# Altium schematic sheet NG2094_IR_Flood.SchDoc: =project_title
size Tabloid; CompanyName: Luxonis Holding; Organization: Luxonis Holding; Address1: 1925 Harmony Park Drive; Address2: Westminster, CO; Address3: 80234; Address4: United States; SheetNumber: 9; SheetTotal: 10
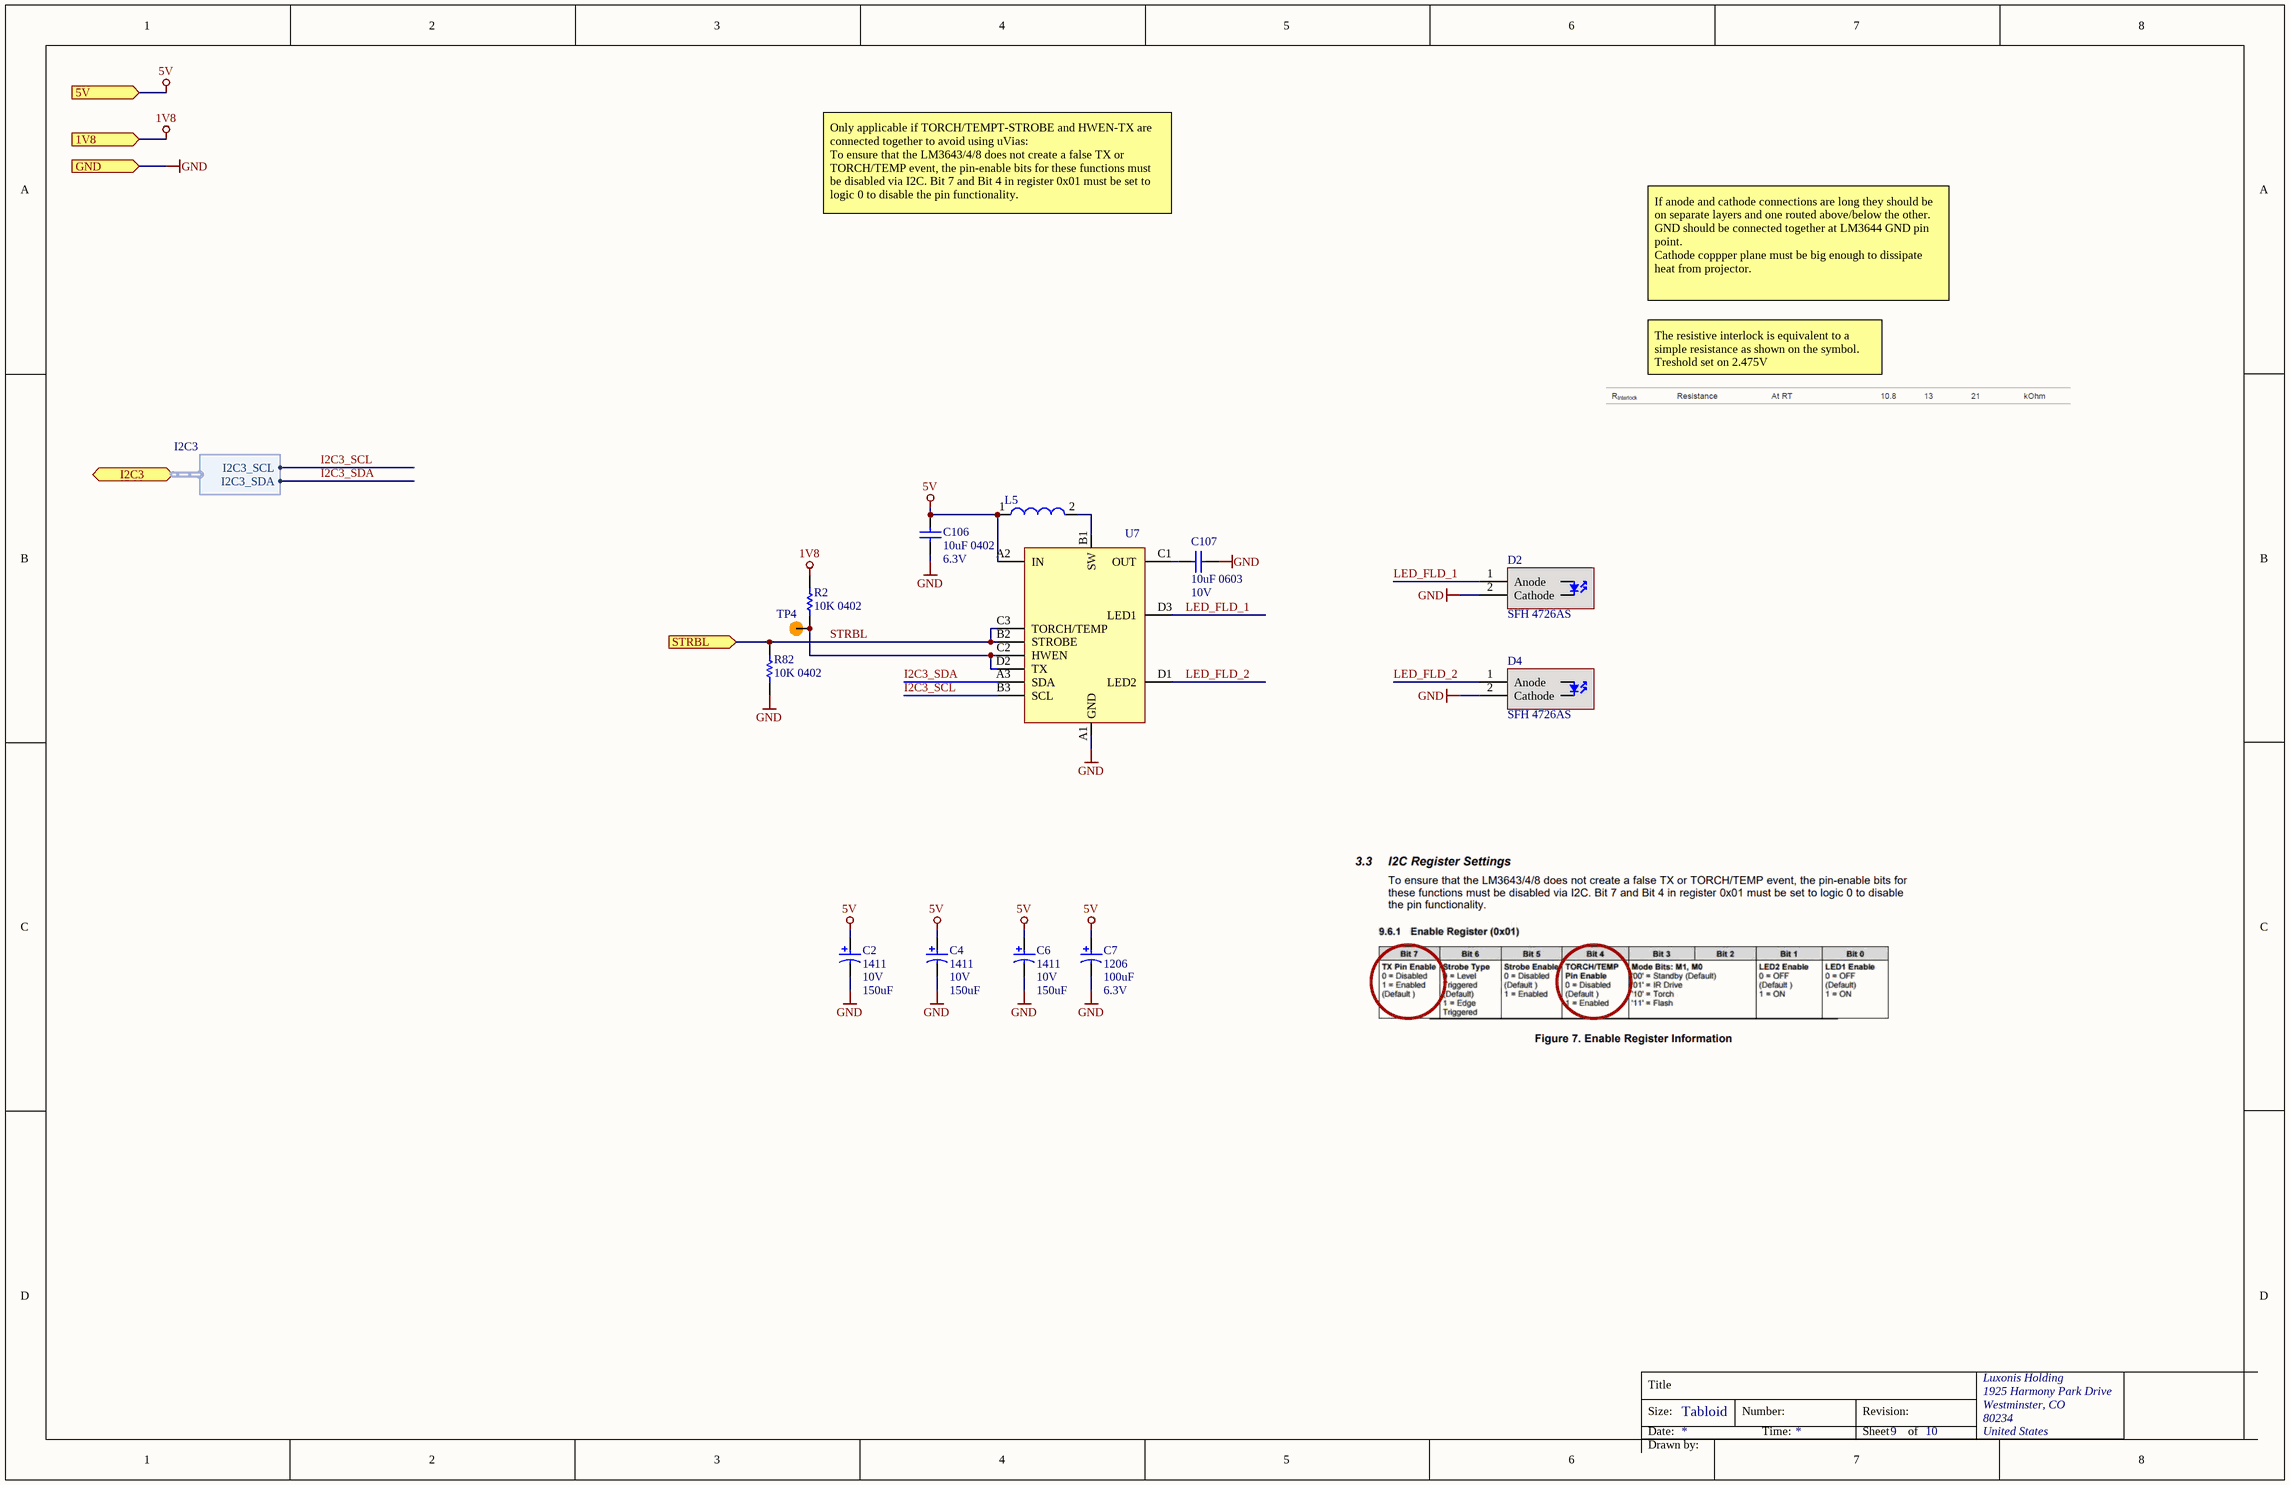
[diagram p0: NG2094_IR_Flood.SchDoc]

## Parts
C2  Size Code: 1411  Rated DC Voltage (URdc): 10V  Capacitance: 150uF  [RESTL1210(3225)_N]  (hidden comment: 150uF 1206 10V tantal)
C4  Size Code: 1411  Rated DC Voltage (URdc): 10V  Capacitance: 150uF  [RESTL1210(3225)_N]  (hidden comment: 150uF 1206 10V tantal)
C6  Size Code: 1411  Rated DC Voltage (URdc): 10V  Capacitance: 150uF  [RESTL1210(3225)_N]  (hidden comment: 150uF 1206 10V tantal)
C7  Size Code: 1206  Capacitance: 100uF  Rated DC Voltage (URdc): 6.3V  [RESTL1206(3216)_L]  (hidden comment: 100uF 1206 6V3 tantal)
C106  10uF 0402  Voltage Rating: 6.3V  [CAPC0402(1005)70_L]
C107  10uF 0603  Voltage Rating: 10V  [CAPC0603(1608)100_L]
D2  SFH 4726AS  [SFH 4726AS]
D4  SFH 4726AS  [SFH 4726AS]
L5  1uH, 3.2A, 20%  [DFE252012P-1R0M=P2]  (value not drawn)
R2  10K 0402  [RESC0402(1005)_L]
R82  10K 0402  [RESC0402(1005)_L]
TP4  TP100_200_NS  [TP100_200_NS]  (value not drawn)  (no BOM)
U7  LM3644YFFR  [LM3644YFFR]  (value not drawn)

## Ports
1V8 (in), 5V (in), GND (in), I2C3 (bidir, harness I2C3), STRBL (in)

## Harnesses
I2C3: I2C3_SCL, I2C3_SDA

## Nets
1V8: R2.2 ; port 1V8
5V: C2.1 C4.1 C6.1 C7.1 C106.2 L5.1 U7.A2(IN) ; port 5V
GND: C2.2 C4.2 C6.2 C7.2 C106.1 C107.2 D2.2(Cathode) D4.2(Cathode) R82.1 U7.A1(GND) ; port GND
I2C3_SCL: U7.B3(SCL) ; port I2C3.I2C3_SCL
I2C3_SDA: U7.A3(SDA) ; port I2C3.I2C3_SDA
LED_FLD_1: D2.1(Anode) U7.D3(LED1)
LED_FLD_2: D4.1(Anode) U7.D1(LED2)
STRBL: R82.2 U7.B2(STROBE) U7.C3(TORCH/TEMP) ; port STRBL
NetC107_1: C107.1 U7.C1(OUT)
NetL5_2: L5.2 U7.B1(SW)
NetR2_1: R2.1 TP4.1 U7.C2(HWEN) U7.D2(TX)

## Notes on the sheet
- Only applicable if TORCH/TEMPT-STROBE and HWEN-TX are connected together to avoid using uVias:
  To ensure that the LM3643/4/8 does not create a false TX or TORCH/TEMP event, the pin-enable bits for these functions must be disabled via I2C. Bit 7 and Bit 4 in register 0x01 must be set to logic 0 to disable the pin functionality.
- If anode and cathode connections are long they should be on separate layers and one routed above/below the other.
  GND should be connected together at LM3644 GND pin point.
  Cathode coppper plane must be big enough to dissipate heat from projector.
- The resistive interlock is equivalent to a simple resistance as shown on the symbol.
  Treshold set on 2.475V
- Title
- Size:
- Date:
- Tabloid
- Number:
- Time:
- Revision:
- Sheet
- of
- Drawn by:

## Library data of the parts
C2 C4 C6 = TLJB157M010R0500: Tantalum Capacitor, Polarized, Tantalum (dry/solid), 10V, 20% +Tol, 20% -Tol, 150uF, Surface Mount, 1210; Manufacturer 1: Kyocera AVX; ESR (Equivalent Series Resistance): 500mR; Leakage Current: 15uA; Ripple Current: 371mA; Supplier 1: Digi-Key; Manufacturer Part Number 1: TLJB157M010R0500; RoHS: Yes; Category: Tantalum Capacitors; Stock 1: 10000; Pricing 1: 1=0,74000, 10=0,54700, 50=0,43800, 100=0,37540, 500=0,29716, 1000=0,25024 (USD); Mount: Surface Mount; Number of Pins: 2; Dielectric Material: Tantalum; Package Shape: Rectangular; Terminal Finish: Nickel; Min Operating Temperature: -55°C; Max Operating Temperature: 125°C; JESD-609 Code: e3; Polarity: Polarized; Capacitor Type: Tantalum; Negative Tolerance: 20%; Package Style: SMTMeter; Packaging: Tape and Reel; Positive Tolerance: 20%; Termination: J BEND; Length: 3.5mm; Width: 2.8mm; Height: 1.9mm; REACH SVHC: Yes; RoHS Compliant: Yes; ComponentLink1URL: https://datasheet.ciiva.com:443/pdfs/VipMasterIC/IC/AVXC/AVXC-S-A0008508048/AVXC-S-A0008508048-1.pdf?src-supplier=IHS+Markit; ComponentLink1Description: https://datasheet.ciiva.com:443/pdfs/VipMasterIC/IC/AVXC/AVXC-S-A0008508048/AVXC-S-A0008508048-1.pdf?src-supplier=IHS+Markit; ComponentLink2URL: https://datasheet.ciiva.com/264/tlj-264786.pdf?src-supplier=Digi-Key; ComponentLink2Description: https://datasheet.ciiva.com/264/tlj-264786.pdf?src-supplier=Digi-Key; ComponentLink3URL: https://datasheet.ciiva.com/264/tlj-264787.pdf?src-supplier=Digi-Key; ComponentLink3Description: https://datasheet.ciiva.com/264/tlj-264787.pdf?src-supplier=Digi-Key; ComponentLink4URL: https://datasheet.ciiva.com/264/tlj-264788.pdf?src-supplier=Digi-Key; ComponentLink4Description: https://datasheet.ciiva.com/264/tlj-264788.pdf?src-supplier=Digi-Key; ComponentLink5URL: https://datasheet.ciiva.com/46385/1910903-46385237.pdf?src-supplier=Element14; ComponentLink5Description: https://datasheet.ciiva.com/46385/1910903-46385237.pdf?src-supplier=Element14; ComponentLink6URL: https://datasheet.ciiva.com/28515/tlj-28515528.pdf?src-supplier=Element14; ComponentLink6Description: https://datasheet.ciiva.com/28515/tlj-28515528.pdf?src-supplier=Element14; ComponentLink7URL: https://datasheet.ciiva.com/7773/1533257-7773833.pdf?src-supplier=Element14; ComponentLink7Description: https://datasheet.ciiva.com/7773/1533257-7773833.pdf?src-supplier=Element14; ComponentLink8URL: https://datasheet.ciiva.com/14593/70001364-14593673.pdf?src-supplier=Allied+Electronics; ComponentLink8Description: https://datasheet.ciiva.com/14593/70001364-14593673.pdf?src-supplier=Allied+Electronics; ComponentLink9URL: https://datasheet.ciiva.com/14606/70001364-14606409.pdf?src-supplier=Allied+Electronics; ComponentLink9Description: https://datasheet.ciiva.com/14606/70001364-14606409.pdf?src-supplier=Allied+Electronics; ComponentLink10URL: https://datasheet.ciiva.com/7773/1533257-7773834.pdf?src-supplier=Element14; ComponentLink10Description: https://datasheet.ciiva.com/7773/1533257-7773834.pdf?src-supplier=Element14; ComponentLink11URL: https://datasheet.ciiva.com/11229/tlj-11229389.pdf?src-supplier=Avnet; ComponentLink11Description: https://datasheet.ciiva.com/11229/tlj-11229389.pdf?src-supplier=Avnet; ComponentLink12URL: https://datasheet.ciiva.com/17339/tlj-17339422.pdf?src-supplier=Avnet+Europe; ComponentLink12Description: https://datasheet.ciiva.com/17339/tlj-17339422.pdf?src-supplier=Avnet+Europe; Supplier Part Number 1: 478-3349-1-ND
C7 = TLJA107M006R0500: Tantalum Capacitor, Polarized, Tantalum (dry/solid), 6.3V, 20% +Tol, 20% -Tol, 100uF, Surface Mount, 1206; Manufacturer 1: Kyocera AVX; ESR (Equivalent Series Resistance): 500mR; Leakage Current: 6uA; Ripple Current: 349mA; Supplier 1: Digi-Key; Manufacturer Part Number 1: TLJA107M006R0500; RoHS: Yes; Category: Tantalum Capacitors; Stock 1: 1699; Pricing 1: 1=0,68000, 10=0,49800, 50=0,39840, 100=0,34150, 500=0,27036, 1000=0,22768 (USD); Mount: Surface Mount; Number of Pins: 2; Dielectric Material: Tantalum; Package Shape: Rectangular; Terminal Finish: Nickel; Min Operating Temperature: -55°C; Max Operating Temperature: 125°C; JESD-609 Code: e3; Polarity: Polarized; Capacitor Type: Tantalum; Negative Tolerance: 20%; Package Style: SMTMeter; Packaging: Tape and Reel; Positive Tolerance: 20%; Termination: J BEND; Length: 3.2mm; Width: 1.6mm; Height: 1.6mm; REACH SVHC: Yes; RoHS Compliant: Yes; ComponentLink1URL: https://datasheet.ciiva.com:443/pdfs/VipMasterIC/IC/AVXC/AVXC-S-A0008508048/AVXC-S-A0008508048-1.pdf?src-supplier=IHS+Markit; ComponentLink1Description: https://datasheet.ciiva.com:443/pdfs/VipMasterIC/IC/AVXC/AVXC-S-A0008508048/AVXC-S-A0008508048-1.pdf?src-supplier=IHS+Markit; ComponentLink2URL: https://datasheet.ciiva.com/3797/21tlj-3797551.pdf?src-supplier=Arrow+Electronics; ComponentLink2Description: https://datasheet.ciiva.com/3797/21tlj-3797551.pdf?src-supplier=Arrow+Electronics; ComponentLink3URL: https://datasheet.ciiva.com/7720/1533257-7720677.pdf?src-supplier=Element14; ComponentLink3Description: https://datasheet.ciiva.com/7720/1533257-7720677.pdf?src-supplier=Element14; ComponentLink4URL: https://datasheet.ciiva.com/28609/packmark-28609461.pdf?src-supplier=Element14; ComponentLink4Description: https://datasheet.ciiva.com/28609/packmark-28609461.pdf?src-supplier=Element14; ComponentLink5URL: https://datasheet.ciiva.com/264/tlj-264694.pdf?src-supplier=Digi-Key; ComponentLink5Description: https://datasheet.ciiva.com/264/tlj-264694.pdf?src-supplier=Digi-Key; ComponentLink6URL: https://datasheet.ciiva.com/264/tlj-264695.pdf?src-supplier=Digi-Key; ComponentLink6Description: https://datasheet.ciiva.com/264/tlj-264695.pdf?src-supplier=Digi-Key; ComponentLink7URL: https://datasheet.ciiva.com/264/tlj-264696.pdf?src-supplier=Digi-Key; ComponentLink7Description: https://datasheet.ciiva.com/264/tlj-264696.pdf?src-supplier=Digi-Key; ComponentLink8URL: https://datasheet.ciiva.com/11229/tlj-11229385.pdf?src-supplier=Avnet; ComponentLink8Description: https://datasheet.ciiva.com/11229/tlj-11229385.pdf?src-supplier=Avnet; ComponentLink9URL: https://datasheet.ciiva.com/28609/1910903-28609449.pdf?src-supplier=Element14; ComponentLink9Description: https://datasheet.ciiva.com/28609/1910903-28609449.pdf?src-supplier=Element14; ComponentLink10URL: https://datasheet.ciiva.com/16501/tlj-16501341.pdf?src-supplier=Future+Electronics; ComponentLink10Description: https://datasheet.ciiva.com/16501/tlj-16501341.pdf?src-supplier=Future+Electronics; ComponentLink11URL: https://datasheet.ciiva.com/14590/70001364-14590207.pdf?src-supplier=Allied+Electronics; ComponentLink11Description: https://datasheet.ciiva.com/14590/70001364-14590207.pdf?src-supplier=Allied+Electronics; Supplier Part Number 1: 478-3345-1-ND
C106 = GRM155R60J106ME15D: CAP CER 10UF 6.3V X5R 0402 20%; Manufacturer 1: Murata; Supplier 1: Digi-Key; Manufacturer Part Number 1: GRM155R60J106ME15D; Stock 1: 1839627; Pricing 1: 1=0.23000, 10=0.15700, 100=0.07950, 500=0.05442, 1000=0.04814, 2500=0.04605, 5000=0.04186 (USD); RoHS: Yes; Mount: Surface Mount; Case/Package: 0402; Case Code (Metric): 1005; Case Code (Imperial): 0402; Min Operating Temperature: -55°C; Max Operating Temperature: 85°C; Packaging: Tape and Reel; Capacitance: 10uF; Dielectric: X5R; Length: 0.039inch; Width: 0.02inch; ComponentLink1URL: https://www.murata.com/~/media/webrenewal/support/library/catalog/products/capacitor/mlcc/c02e.ashx?la=en-us&src-supplier=Digi-Key; ComponentLink1Description: https://www.murata.com/~/media/webrenewal/support/library/catalog/products/capacitor/mlcc/c02e.ashx?la=en-us&src-supplier=Digi-Key; Supplier Part Number 1: 490-13238-1-ND; Voltage Rating (DC): 6.3V; Thickness: 0.026inch; Tolerance: 20%
C107 = GRM188R61A106ME69D: CAP CER 10UF 10V X5R 0603 20%; Manufacturer 1: Murata; Material: Ceramic; Supplier 1: Digi-Key; Manufacturer Part Number 1: GRM188R61A106ME69D; Stock 1: 2873098; Pricing 1: 1=0.21000, 10=0.14100, 100=0.07130, 500=0.04876, 1000=0.04313 (USD); RoHS: Yes; Mount: Surface Mount; Case/Package: 0603; Weight: 0.000222oz; Case Code (Metric): 1608; Case Code (Imperial): 0603; Min Operating Temperature: -55°C; Max Operating Temperature: 85°C; Packaging: Tape and Reel; Tolerance: 20%; Capacitance: 10uF; Dielectric: X5R; Voltage Rating (DC): 10V; Package Quantity: 4000; Termination: SMD/SMT; Length: 1.6mm; Height: 0.8mm; Width: 0.8mm; Thickness: 0.035inch; Depth: 0.8mm; REACH SVHC: Unknown; Lead Free: Lead Free; ComponentLink1URL: http://www.mouser.com/ds/2/281/c02e-2905.pdf?src-supplier=Mouser; ComponentLink1Description: http://www.mouser.com/ds/2/281/c02e-2905.pdf?src-supplier=Mouser; ComponentLink2URL: http://components.arrow.com/part/dataview/0323_06119472?src-supplier=Arrow+Europe; ComponentLink2Description: http://components.arrow.com/part/dataview/0323_06119472?src-supplier=Arrow+Europe; ComponentLink3URL: http://www.farnell.com/datasheets/2048014.pdf?src-supplier=Farnell; ComponentLink3Description: http://www.farnell.com/datasheets/2048014.pdf?src-supplier=Farnell; ComponentLink4URL: http://www.farnell.com/datasheets/1872210.pdf?src-supplier=Farnell; ComponentLink4Description: http://www.farnell.com/datasheets/1872210.pdf?src-supplier=Farnell; ComponentLink5URL: http://search.murata.co.jp/Ceramy/image/img/A01X/G101/ENG/GRM188R61A106ME69-01.pdf?src-supplier=Digi-Key; ComponentLink5Description: http://search.murata.co.jp/Ceramy/image/img/A01X/G101/ENG/GRM188R61A106ME69-01.pdf?src-supplier=Digi-Key; ComponentLink6URL: http://www.farnell.com/datasheets/1872210.pdf?src-supplier=Newark; ComponentLink6Description: http://www.farnell.com/datasheets/1872210.pdf?src-supplier=Newark; ComponentLink7URL: http://www.farnell.com/datasheets/2048014.pdf?src-supplier=Element14; ComponentLink7Description: http://www.farnell.com/datasheets/2048014.pdf?src-supplier=Element14; ComponentLink8URL: http://www.farnell.com/datasheets/2048014.pdf?src-supplier=Newark; ComponentLink8Description: http://www.farnell.com/datasheets/2048014.pdf?src-supplier=Newark; Supplier Part Number 1: 490-10475-1-ND
D2 D4 = SFH 4726AS: OSLON Black Series (940 nm) - 150°; Manufacturer 1: Osram Opto; Manufacturer Part Number 1: SFH 4726AS A01; Optoelectronic Device Type: INFRARED LED; Supplier 1: Newark; RoHS: Yes; Category: LEDs; REACH SVHC: Yes; RoHS Compliant: Yes; ComponentLink1URL: https://datasheet.ciiva.com:443/pdfs/VipMasterIC/IC/OSOS/OSOS-S-A0009010498/OSOS-S-A0009010498-1.pdf?src-supplier=IHS+Markit; ComponentLink1Description: https://datasheet.ciiva.com:443/pdfs/VipMasterIC/IC/OSOS/OSOS-S-A0009010498/OSOS-S-A0009010498-1.pdf?src-supplier=IHS+Markit; ComponentLink2URL: http://www.farnell.com/datasheets/2711624.pdf?src-supplier=Farnell; ComponentLink2Description: http://www.farnell.com/datasheets/2711624.pdf?src-supplier=Farnell; Supplier Part Number 1: 94AC5058; Stock 1: 628; Pricing 1: 1=4,49000, 10=3,74000, 25=3,35000, 50=2,97000, 100=2,58000 (USD)
L5 = DFE252012P-1R0M=P2: FIXED IND 1UH 3.2A 42 MOHM SMD; Manufacturer: Murata; Core Material: Ferrite; Current Rating: 4.3A; Shielding: Shielded; Test Frequency: 1MHz; DC Resistance (DCR): 42mR; RoHS: Yes; Mount: Surface Mount; Case/Package: 1008; Case Code (Metric): 2520; Min Operating Temperature: -40°C; Max Operating Temperature: 125°C; Packaging: Tape and Reel; Composition: Wirewound; Length: 0.098inch; Width: 0.079inch; Height - Seated (Max): 0.039inch; Depth: 2mm; ComponentLink1URL: http://www.farnell.com/datasheets/2550134.pdf?src-supplier=Farnell; ComponentLink1Description: http://www.farnell.com/datasheets/2550134.pdf?src-supplier=Farnell; ComponentLink2URL: https://www.murata.com/~/media/webrenewal/products/inductor/chip/tokoproducts/wirewoundmetalalloychiptype/m_dfe252012p.ashx?src-supplier=Digi-Key; ComponentLink2Description: https://www.murata.com/~/media/webrenewal/products/inductor/chip/tokoproducts/wirewoundmetalalloychiptype/m_dfe252012p.ashx?src-supplier=Digi-Key; ComponentLink3URL: http://www.murata.com/~/media/webrenewal/products/inductor/chip/tokoproducts/wirewoundmetalalloychiptype/m_dfe252012p.ashx?src-supplier=Digi-Key; ComponentLink3Description: http://www.murata.com/~/media/webrenewal/products/inductor/chip/tokoproducts/wirewoundmetalalloychiptype/m_dfe252012p.ashx?src-supplier=Digi-Key; ComponentLink4URL: http://www.toko.co.jp/products/pdf/inductors/dfe252012p.pdf?src-supplier=Avnet; ComponentLink4Description: http://www.toko.co.jp/products/pdf/inductors/dfe252012p.pdf?src-supplier=Avnet; Supplier 1: Digi-Key; Manufacturer 1: Murata; Manufacturer Part Number 1: DFE252012P-1R0M=P2; Stock 1: 2560; Pricing 1: 1=0.43000, 10=0.37800, 100=0.27030, 500=0.22702, 1000=0.18377 (USD); Supplier Part Number 1: 490-10647-1-ND; Max DC Current: 3.2A; Tolerance: 20%; Case Code (Imperial): 1008; Supplier 2: Digi-Key; Manufacturer 2: Murata; Manufacturer Part Number 2: DFE252012P-1R0M=P2; Stock 2: 95; Pricing 2: 1=0.43000, 10=0.37800, 100=0.27030, 500=0.22702, 1000=0.18377 (USD); Supplier 3: Mouser; Stock 3: 667; Pricing 3: 1=0.43000, 10=0.37900, 50=0.37900, 100=0.27000, 1000=0.18400, 10000=0.14600 (USD); Supplier 4: Element14; Stock 4: 41; Pricing 4: 1=0.64000, 10=0.56500, 100=0.40500, 500=0.34000, 1000=0.27500 (SGD); Supplier Part Number 4: 2530071; Supplier Part Number 3: 81-DFE252012P-1R0MP2; Supplier Part Number 2: 490-10647-6-ND; Inductance: 1uH
R2 R82 = RC0402FR-1310KL: RES SMD 10K OHM 1% 0402 1/16W Chip Resistor, 0402 [1005 Metric], 10 kohm, RC Series, 50 V, Thick Film, 62.5 mW; Manufacturer 1: Yageo; Resistance: 10kR; Temperature Coefficient: 100ppm/°C; Power Rating: 62.5mW; Voltage Rating: 50V; ComponentLink1URL: https://datasheet.ciiva.com/16940/pyu-rc0402-51-rohs-l-6-16940293.pdf?src-supplier=Avnet+Europe; ComponentLink1Description: https://datasheet.ciiva.com/16940/pyu-rc0402-51-rohs-l-6-16940293.pdf?src-supplier=Avnet+Europe; ComponentLink2URL: https://datasheet.ciiva.com/28386/pyu-rc0402-51-rohs-l-6-28386855.pdf?src-supplier=Avnet+Europe; ComponentLink2Description: https://datasheet.ciiva.com/28386/pyu-rc0402-51-rohs-l-6-28386855.pdf?src-supplier=Avnet+Europe; ComponentLink3URL: https://datasheet.ciiva.com/16740/pyu-rc0402-51-rohs-l-6-r-16740602.pdf?src-supplier=Future+Electronics; ComponentLink3Description: https://datasheet.ciiva.com/16740/pyu-rc0402-51-rohs-l-6-r-16740602.pdf?src-supplier=Future+Electronics; ComponentLink4URL: https://datasheet.ciiva.com/8891/pyu-rc0402-51-rohs-l-6-8891339.pdf?src-supplier=Avnet; ComponentLink4Description: https://datasheet.ciiva.com/8891/pyu-rc0402-51-rohs-l-6-8891339.pdf?src-supplier=Avnet; ComponentLink5URL: https://datasheet.ciiva.com/5557/pyu-rc0402-51-rohs-l-6-r-5557997.pdf?src-supplier=Mouser; ComponentLink5Description: https://datasheet.ciiva.com/5557/pyu-rc0402-51-rohs-l-6-r-5557997.pdf?src-supplier=Mouser; ComponentLink6URL: https://datasheet.ciiva.com/7983/1018594-7983533.pdf?src-supplier=Element14; ComponentLink6Description: https://datasheet.ciiva.com/7983/1018594-7983533.pdf?src-supplier=Element14; Supplier 1: Newark; Manufacturer Part Number 1: RC0402FR-1310KL; Stock 1: 62239; Pricing 1: 1=0.10000, 25=0.01200, 100=0.00400, 250=0.00400, 500=0.00300, 1000=0.00300 (USD); RoHS: Yes; Case/Package: 0402; Number of Pins: 2; Contact Plating: Tin,Matte,Lead; Case Code (Imperial): 0402; Case Code (Metric): 1005; Min Operating Temperature: -55°C; Max Operating Temperature: 155°C; Tolerance: 1%; Composition: Thick Film; Packaging: Tape and Reel; Termination: SMD/SMT; Military Standard: Not; Voltage Rating (DC): 50V; Working Voltage: 50V; Number of Terminations: 2; Length: 1mm; Depth: 0.5mm; Radiation Hardening: No; REACH SVHC: No SVHC; Lead Free: Lead Free; Supplier Part Number 1: 67R9960; Supplier 2: Future Electronics; Supplier 3: Mouser; Supplier 4: Element14; Supplier Part Number 2: RC0402FR-1310KL-CUTT; Supplier Part Number 3: 603-RC0402FR-1310KL; Supplier Part Number 4: 1799235
TP4 = TEST_POINT
U7 = LM3644: LED Driver, 2-Segment, PBGA12; Manufacturer 1: Texas Instruments; Package Body Material: Plastic; Data Input Mode: SERIAL; Interface IC Type: LED DISPLAY DRIVER; Multiplexed Display Capability: No; Number of Functions: 1; Number of Segments: 2; Max Supply Voltage: 5.5V; Min Supply Voltage: 2.5V; Supply Voltage-Nom: 3.6V; Supplier 1: Arrow Electronics; Manufacturer Part Number 1: LM3644YFFR; RoHS: Yes; Category: LED Drivers; Stock 1: 2033; Pricing 1: 1=0,64580, 10=0,63600, 25=0,62590, 100=0,61590, 250=0,60610, 500=0,59600, 1000=0,58600, 3000=0,35000, 30000=0,34520, 300000=0,31610, 1500000=0,29870, 3000000=0,29850 (USD); Package Code: VFBGA; Number of Pins: 12; Package Shape: Rectangular; Terminal Finish: Copper; Min Operating Temperature: -40°C; Max Operating Temperature: 85°C; JESD-609 Code: e1; Moisture Sensitivity Level: 1; Package Style: GRID ARRAY, VERY THIN PROFILE, FINE PITCHMeter; Peak Reflow Temperature (Cel): 260°C; Surface Mount: Yes; Terminal Form: Ball; Terminal Position: BOTTOM; Length: 1.66mm; Width: 1.28mm; Height - Seated (Max): 0.625mm; Terminal Pitch: 0.4mm; Temperature Grade: INDUSTRIAL; REACH SVHC: Yes; RoHS Compliant: Yes; ComponentLink1URL: https://www.ti.com:443/lit/ds/symlink/lm3644.pdf?src-supplier=IHS+Markit; ComponentLink1Description: https://www.ti.com:443/lit/ds/symlink/lm3644.pdf?src-supplier=IHS+Markit; ComponentLink2URL: https://datasheet.ciiva.com/48475/lm3644-48475318.pdf?src-supplier=Avnet; ComponentLink2Description: https://datasheet.ciiva.com/48475/lm3644-48475318.pdf?src-supplier=Avnet; Supplier Part Number 1: LM3644YFFR